# EAGLE design dc-power-board (EAGLE 5.10)
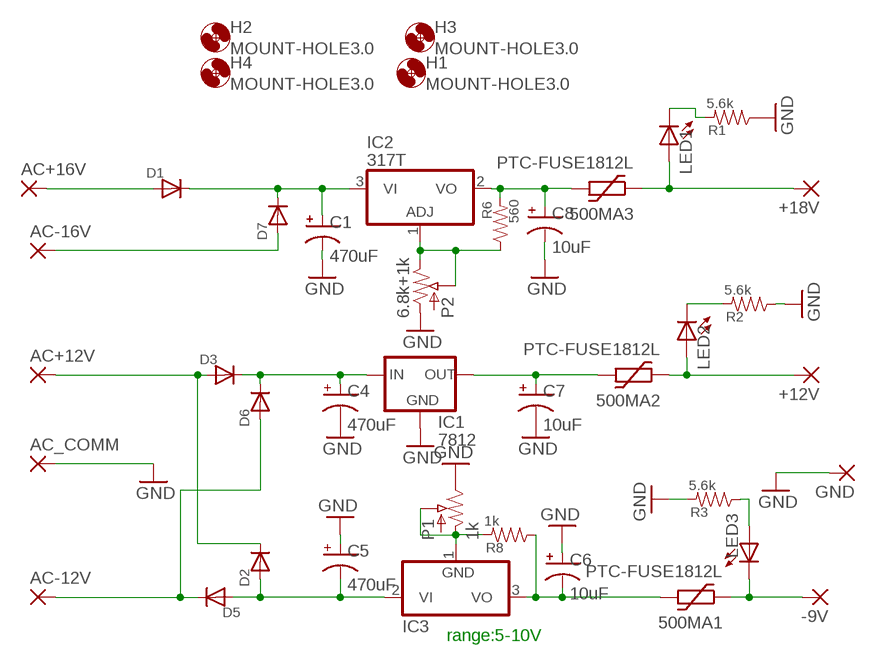
[diagram p0: schematic, sheet 1]

## Parts
500MA1  PTC-FUSE1812L  [1812L]
500MA2  PTC-FUSE1812L  [1812L]
500MA3  PTC-FUSE1812L  [1812L]
+12V  WIREPADSMD5-2,5  [5-2,5]
+18V  WIREPADSMD5-2,5  [5-2,5]
-9V  WIREPADSMD5-2,5  [5-2,5]
AC+12V  WIREPADSMD5-2,5  [5-2,5]
AC+16V  WIREPADSMD5-2,5  [5-2,5]
AC-12V  WIREPADSMD5-2,5  [5-2,5]
AC-16V  WIREPADSMD5-2,5  [5-2,5]
AC_COMM  WIREPADSMD5-2,5  [5-2,5]
C1  470uF  CAP_POLPTH1  [CPOL-RADIAL-100UF-25V]
C4  470uF  CAP_POLPTH1  [CPOL-RADIAL-100UF-25V]
C5  470uF  CAP_POLPTH1  [CPOL-RADIAL-100UF-25V]
C6  10uF  CAP_POLPTH1  [CPOL-RADIAL-100UF-25V]
C7  10uF  CAP_POLPTH1  [CPOL-RADIAL-100UF-25V]
C8  10uF  CAP_POLPTH1  [CPOL-RADIAL-100UF-25V]
D1  DIODEDO35-10  [DO35-10]
D2  DIODEDO35-10  [DO35-10]
D3  DIODEDO35-10  [DO35-10]
D5  DIODEDO35-10  [DO35-10]
D6  DIODEDO35-10  [DO35-10]
D7  DIODEDO35-10  [DO35-10]
GND  WIREPADSMD5-2,5  [5-2,5]
H1  MOUNT-HOLE3.0  [3,0]
H2  MOUNT-HOLE3.0  [3,0]
H3  MOUNT-HOLE3.0  [3,0]
H4  MOUNT-HOLE3.0  [3,0]
IC1  7812  V_REG_78XXSIDE  [78XXL]
IC2  317T  [TO220H]
IC3  7905T  [TO220H]
LED1  LED3MM  [LED3MM]
LED2  LED3MM  [LED3MM]
LED3  LED3MM  [LED3MM]
P1  1k  POTB25P-3362P  [B25P]
P2  6.8k+1k  POTB25P-3362P  [B25P]
R1  5.6k  RESISTOR0207/7(1/4W)  [0207/7]
R2  5.6k  RESISTOR0207/7(1/4W)  [0207/7]
R3  5.6k  RESISTOR0207/7(1/4W)  [0207/7]
R6  560  RESISTOR1/4W  [AXIAL-0.3]
R8  1k  RESISTOR1/4W  [AXIAL-0.3]

## Nets
AC+12V: AC+12V.1(P) D2.C D3.A
GND: AC_COMM.1(P) C1.2(-) C4.2(-) C5.1(+) C6.1(+) C7.2(-) C8.2(-) GND.1(P) IC1.GND P1.E P2.A R1.1 R2.1 R3.2
N$1: C1.1(+) D1.C D7.C IC2.3(VI)
N$2: 500MA1.P$1 -9V.1(P) LED3.K(C)
N$3: LED3.A R3.1
N$4: AC+16V.1(P) D1.A
N$5: 500MA3.P$2 C8.1(+) IC2.2(VO) R6.P$2
N$6: C4.1(+) D3.C D6.C IC1.IN
N$7: 500MA2.P$1 +12V.1(P) LED2.A
N$8: 500MA3.P$1 +18V.1(P) LED1.A
N$9: LED1.K(C) R1.2
N$10: AC-12V.1(P) D5.C D6.A
N$11: AC-16V.1(P) D7.A
N$12: C5.2(-) D2.A D5.A IC3.2(VI)
N$13: 500MA2.P$2 C7.1(+) IC1.OUT
N$14: 500MA1.P$2 C6.2(-) IC3.3(VO) R8.P$1
N$15: IC3.1(GND) P1.A P1.S R8.P$2
N$16: IC2.1(ADJ) P2.E P2.S R6.P$1
N$17: LED2.K(C) R2.2

## Notes on the sheet
- range:5-10V

## Library data of the parts
500MA1-500MA3 = digital-toy:PTC-FUSE
+12V +18V -9V AC+12V AC+16V AC-12V AC-16V AC_COMM GND = wirepad:WIREPAD: Wire PAD connect wire on PCB
C1 C4-C8 = digital-toy:CAP_POL: Capacitor Polarized These are standard SMD and PTH capacitors. Normally 10uF, 47uF, and 100uF in electrolytic and tantalum varieties. Always verify the external diameter of the through hole cap, it varies with capacity, voltage, and manufacturer. The EIA devices should be standard. PANASONIC_D size: 6.5mmx6.5mmx5.5mm, 100uf (taobao:6.3mmx5.5mm), same as CVL0605 153cvl0405 size: 4mmx4mmx5.5mm, 10uf (taobao:4mmx5.5mm) ct6032 typical 47uF Tantalum, comment by hyl.
D1-D3 D5-D7 = digital-toy:DIODE: Diode These are standard reverse protection diodes and small signal diodes. SMA package can handle up to about 1A. SOD-323 can handle about 200mA. What the SOD-323 package when ordering, there are some mfgs out there that are 5-pin packages.
H1-H4 = holes:MOUNT-HOLE: MOUNTING HOLE with drill center marker
IC1 = SparkFun:V_REG_78XX: Voltage Regulator Standard 7805 5V regulator. IGO (Input Ground Output). Spark Fun Electronics SKU : COM-00107
IC2 = linear:*317: Positive VOLTAGE REGULATOR
IC3 = linear:79*: Negative VOLTAGE REGULATOR
LED1-LED3 = digital-toy:LED: LEDs Standard schematic elements and footprints for 5mm, 3mm, 1206, and 0603 sized LEDs. 5mm - Spark Fun Electronics SKU : COM-00529 (and others) copy led.lbr 0805 led here, by hyl digital-toy. 2010.6.29
P1 P2 = digital-toy:POT: POT digital toy POT, 3296 multi turn, blue-white ... hyl 8/07/2001
R1-R3 R6 R8 = digital-toy:RESISTOR: Resistor Basic schematic elements and footprints for 0603, 1206, and PTH 1/10th watt (small) resistors. digital-toy copy vertical mount of axial-0.3 from rcl.lbr : the 0207/xx 3W resistor: 0617/17, 0617/22, 0617V

## Board
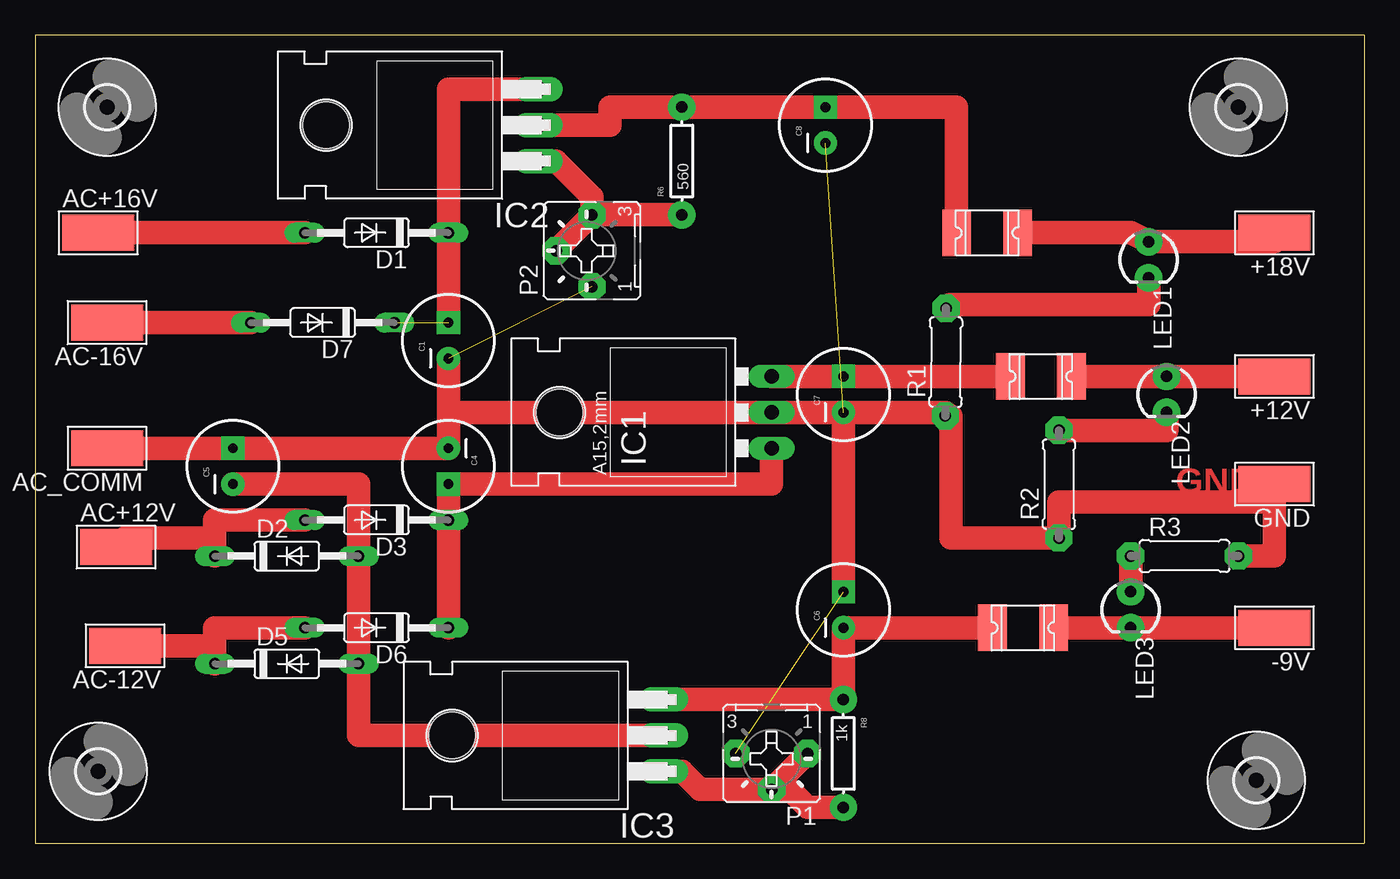
[diagram p1: board, top side]

Size 93.98 x 57.15 mm. Coordinates in mm from the lower left corner, seen from the top.
Outline: 0,0 93.98,0 93.98,57.15 0,57.15 0,0
Copper layers (1*16): Top 0.035mm / dielectric 1.5mm / Bottom 0.035mm
Design rules "SparkFun": minimum track width 8mil, minimum drill 20mil, track to track 8mil, track to pad 8mil, pad to pad 8mil, via to via 8mil, smd to smd 8mil, copper to edge 10mil, drill to drill 8mil, minimum pad ring 12mil, minimum via ring 10mil, stop-mask expansion 4mil, vias tented up to drill 25mil, thermal gap 10mil

### Footprints (pad centres in the part's own frame; a part is rotated, then mirrored left to right if it is on the bottom)
1812L = smd 2.03 x 3.3: P$1 -2.16,0; P$2 2.16,0
5-2,5 = smd 2.54 x 5.08: 1 0,0
CPOL-RADIAL-100UF-25V = drill 0.7 pad 1.651 square: 1 1.27,0 | drill 0.7 pad 1.651 round: 2 -1.27,0
DO35-10 = drill 0.813 long: A 5.08,0; C -5.08,0
3,0 = hole 3: 0,0
78XXL = drill 1.016 long: GND 0,-3.81; IN -2.54,-3.81; OUT 2.54,-3.81 | hole 3.302: 0,11.176
TO220H = drill 1.118 long: 1 -2.54,-10.16; 2 0,-10.16; 3 2.54,-10.16 | hole 3.302: 0,4.826
LED3MM = drill 0.813 pad 1.93 round: A -1.27,0; K 1.27,0
B25P = drill 0.813 pad 1.93 octagon: A -2.54,0; E 2.54,0; S 0,2.54
0207/7 = drill 0.813 pad 1.93 octagon: 1 -3.81,0; 2 3.81,0
AXIAL-0.3 = drill 0.813 pad 1.93 round: P$1 -3.81,0; P$2 3.81,0

### Placement (x,y rotation side)
500MA1  69.85,15.24 180 top
500MA2  71.12,33.02 180 top
500MA3  67.31,43.18 180 top
+12V  87.63,33.02 90 top
+18V  87.63,43.18 90 top
-9V  87.63,15.24 90 top
AC+12V  5.71,20.95 270 top
AC+16V  4.45,43.18 270 top
AC-12V  6.35,13.97 90 top
AC-16V  5.08,36.83 90 top
AC_COMM  5.08,27.94 90 top
C1  29.21,35.56 90 top
C4  29.21,26.67 270 top
C5  13.97,26.67 90 top
C6  57.15,16.51 90 top
C7  57.15,31.75 90 top
C8  55.88,50.8 90 top
D1  24.13,43.18 180 top
D2  17.78,20.32 0 top
D3  24.13,22.86 180 top
D5  17.78,12.7 0 top
D6  24.13,15.24 180 top
D7  20.32,36.83 180 top
GND  87.63,25.4 90 top
H1  4.45,5.08 0 top
H2  85.09,52.07 0 top
H3  86.36,4.45 0 top
H4  5.08,52.07 0 top
IC1  48.26,30.48 90 top
IC2  25.4,50.8 90 top
IC3  34.29,7.62 90 top
LED1  78.74,41.27 270 top
LED2  80.01,31.75 270 top
LED3  77.47,16.51 270 top
P1  52.07,6.35 180 top
P2  39.37,41.91 90 top
R1  64.39,34.04 89.6 top
R2  72.39,25.4 90 top
R3  81.28,20.32 0 top
R6  45.72,48.26 90 top
R8  57.15,6.35 270 top

### Tracks (layer width: path | path; a pad name or v marks a point on that pad's centre or on a via)
AC+12V
  Top 1.676: D3.A 12.7,22.86 12.7,21.59 | 12.7,21.59 D2.C | AC+12V.1 6.35,21.59 12.7,21.59
GND  (3 unrouted)
  Top 1.676: AC_COMM.1 C5.1 C4.2 29.21,30.48 | 29.21,30.48 C1.2 | C7.2 IC1.GND 29.21,30.48 | C7.2 64.36,30.48 R1.1 64.77,30.23 64.77,21.59 R2.1 72.39,24.13 87.63,24.13 | R3.2 87.63,20.32 87.63,24.13 | 87.63,24.13 GND.1 | C7.2 C6.1
N$1  (1 unrouted)
  Top 1.676: C1.1 D1.C 29.21,53.34 IC2.3
N$2
  Top 1.676: 500MA1.P$1 LED3.K -9V.1
N$3
  Top 1.676: LED3.A R3.1
N$4
  Top 1.676: AC+16V.1 D1.A
N$5
  Top 1.676: IC2.2 40.64,50.8 40.64,52.07 R6.P$2 C8.1 65.15,52.07 500MA3.P$2
N$6
  Top 1.676: D6.C D3.C C4.1 52.07,25.4 IC1.IN
N$7
  Top 1.676: +12V.1 LED2.A 500MA2.P$1
N$8
  Top 1.676: 500MA3.P$1 77.47,43.18 LED1.A 87.63,42.55 +18V.1
N$9
  Top 1.676: R1.2 64.67,38.1 78.74,38.1 LED1.K
N$10
  Top 1.676: AC-12V.1 12.7,13.97 | 12.7,13.97 D5.C | D6.A 12.7,15.24 12.7,13.97
N$11
  Top 1.676: AC-16V.1 D7.A
N$12
  Top 1.676: C5.2 22.86,25.4 D2.A D5.A 22.86,7.62 IC3.2
N$13
  Top 1.676: 500MA2.P$2 C7.1 IC1.OUT
N$14
  Top 1.676: 500MA1.P$2 C6.2 R8.P$1 IC3.3
N$15
  Top 1.676: R8.P$2 54.61,2.54 53.34,3.81 P1.S | IC3.1 45.72,5.08 46.99,3.81 P1.S | P1.S P1.A
N$16
  Top 1.676: IC2.1 36.83,48.26 39.37,45.72 P2.E | P2.S P2.E | P2.E R6.P$1
N$17
  Top 1.676: R2.2 80.01,29.21 LED2.K

### Text on the board
Top: GND